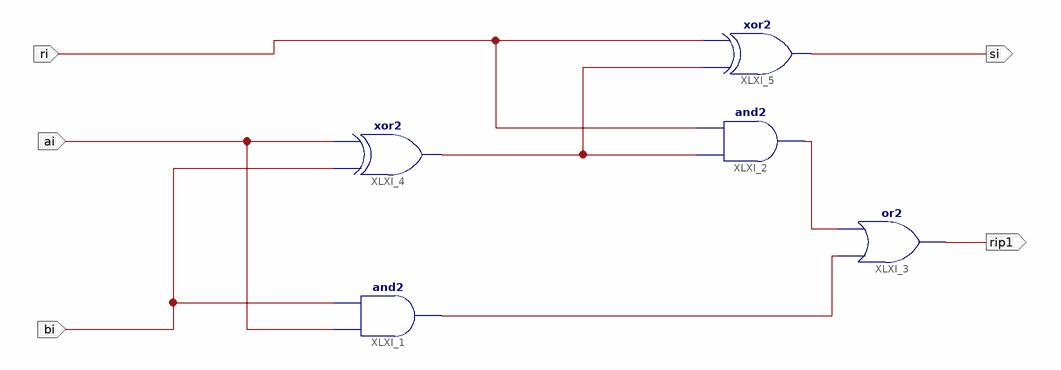
[diagram p0: schematic sheet 1]
// Xilinx ISE schematic ADD_FA_1bit.sch (artix7) as structural Verilog: 5 symbols, 5 ports
module ADD_FA_1bit (
  input  ri,
  input  bi,
  input  ai,
  output rip1,
  output si
);

  wire XLXN_6, XLXN_7, XLXN_9;

  and XLXI_1 (XLXN_7, ai, bi);
  and XLXI_2 (XLXN_6, XLXN_9, ri);
  or XLXI_3 (rip1, XLXN_7, XLXN_6);
  xor XLXI_4 (XLXN_9, bi, ai);
  xor XLXI_5 (si, XLXN_9, ri);
endmodule
